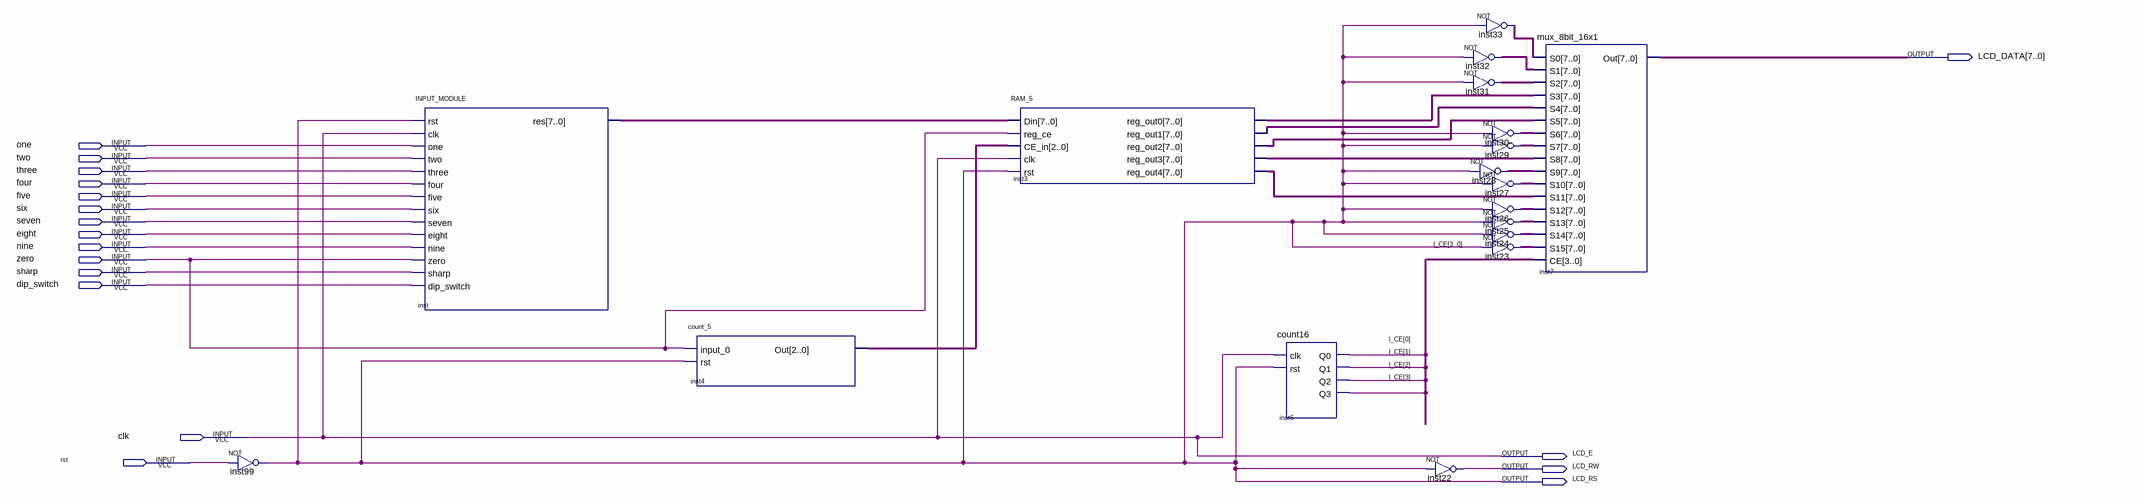
[diagram p0: schematic sheet]
// Quartus schematic PROJECT.bdf as structural Verilog: 18 symbols, 18 pins
module PROJECT (
  input  one,
  input  two,
  input  three,
  input  four,
  input  five,
  input  six,
  input  seven,
  input  eight,
  input  nine,
  input  zero,
  input  sharp,
  input  dip_switch,
  input  clk,
  input  rst,
  output [7:0] LCD_DATA,
  output LCD_E,
  output LCD_RW,
  output LCD_RS
);

  wire [2:0] inst4_out;
  wire [3:0] l_CE;
  wire [7:0] inst3_reg_out0, inst3_reg_out1, inst3_reg_out2, inst3_reg_out3, inst3_reg_out4, inst23_out,
       inst24_out, inst25_out, inst26_out, inst27_out, inst28_out, inst29_out, inst30_out, inst31_out,
       inst32_out, inst33_out, inst_res;

  not inst99 (LCD_RS, rst);
  INPUT_MODULE inst (
    .rst(LCD_RS), .clk(clk), .one(one), .two(two), .three(three), .four(four), .five(five), .six(six),
    .seven(seven), .eight(eight), .nine(nine), .zero(zero), .sharp(sharp), .dip_switch(dip_switch),
    .res(inst_res));
  count_5 inst4 (.input_0(zero), .rst(LCD_RS), .Out(inst4_out));
  RAM_5 inst3 (
    .Din(inst_res), .reg_ce(zero), .CE_in(inst4_out), .clk(clk), .rst(LCD_RS), .reg_out0(inst3_reg_out0),
    .reg_out1(inst3_reg_out1), .reg_out2(inst3_reg_out2), .reg_out3(inst3_reg_out3), .reg_out4(inst3_reg_out4));
  count16 inst6 (.clk(clk), .rst(LCD_RS), .Q0(l_CE[0]), .Q1(l_CE[1]), .Q2(l_CE[2]), .Q3(l_CE[3]));
  not inst22 (LCD_RW, LCD_RS);
  assign inst33_out = ~{8{LCD_RS}};  // NOT inst33, 8 bits wide
  assign inst32_out = ~{8{LCD_RS}};  // NOT inst32, 8 bits wide
  assign inst31_out = ~{8{LCD_RS}};  // NOT inst31, 8 bits wide
  assign inst30_out = ~{8{LCD_RS}};  // NOT inst30, 8 bits wide
  assign inst29_out = ~{8{LCD_RS}};  // NOT inst29, 8 bits wide
  assign inst28_out = ~{8{LCD_RS}};  // NOT inst28, 8 bits wide
  assign inst27_out = ~{8{LCD_RS}};  // NOT inst27, 8 bits wide
  assign inst26_out = ~{8{LCD_RS}};  // NOT inst26, 8 bits wide
  assign inst25_out = ~{8{LCD_RS}};  // NOT inst25, 8 bits wide
  assign inst24_out = ~{8{LCD_RS}};  // NOT inst24, 8 bits wide
  assign inst23_out = ~{8{LCD_RS}};  // NOT inst23, 8 bits wide
  mux_8bit_16x1 inst7 (
    .S0(inst33_out), .S1(inst32_out), .S2(inst31_out), .S3(inst3_reg_out0), .S4(inst3_reg_out1),
    .S5(inst3_reg_out2), .S6(inst30_out), .S7(inst29_out), .S8(inst3_reg_out3), .S9(inst28_out),
    .S10(inst27_out), .S11(inst3_reg_out4), .S12(inst26_out), .S13(inst25_out), .S14(inst24_out),
    .S15(inst23_out), .CE(l_CE), .Out(LCD_DATA));

  assign LCD_E = clk;
endmodule
